# EasyEDA schematic SCH_N64-PSU_2023-12-16.json
TITLE: N64 DC Power Board; REV: 1.0; Date: 2023-05-23; Sheet: 1/1; Drawn By: jonn.blanchard; Company: RE:Enthused
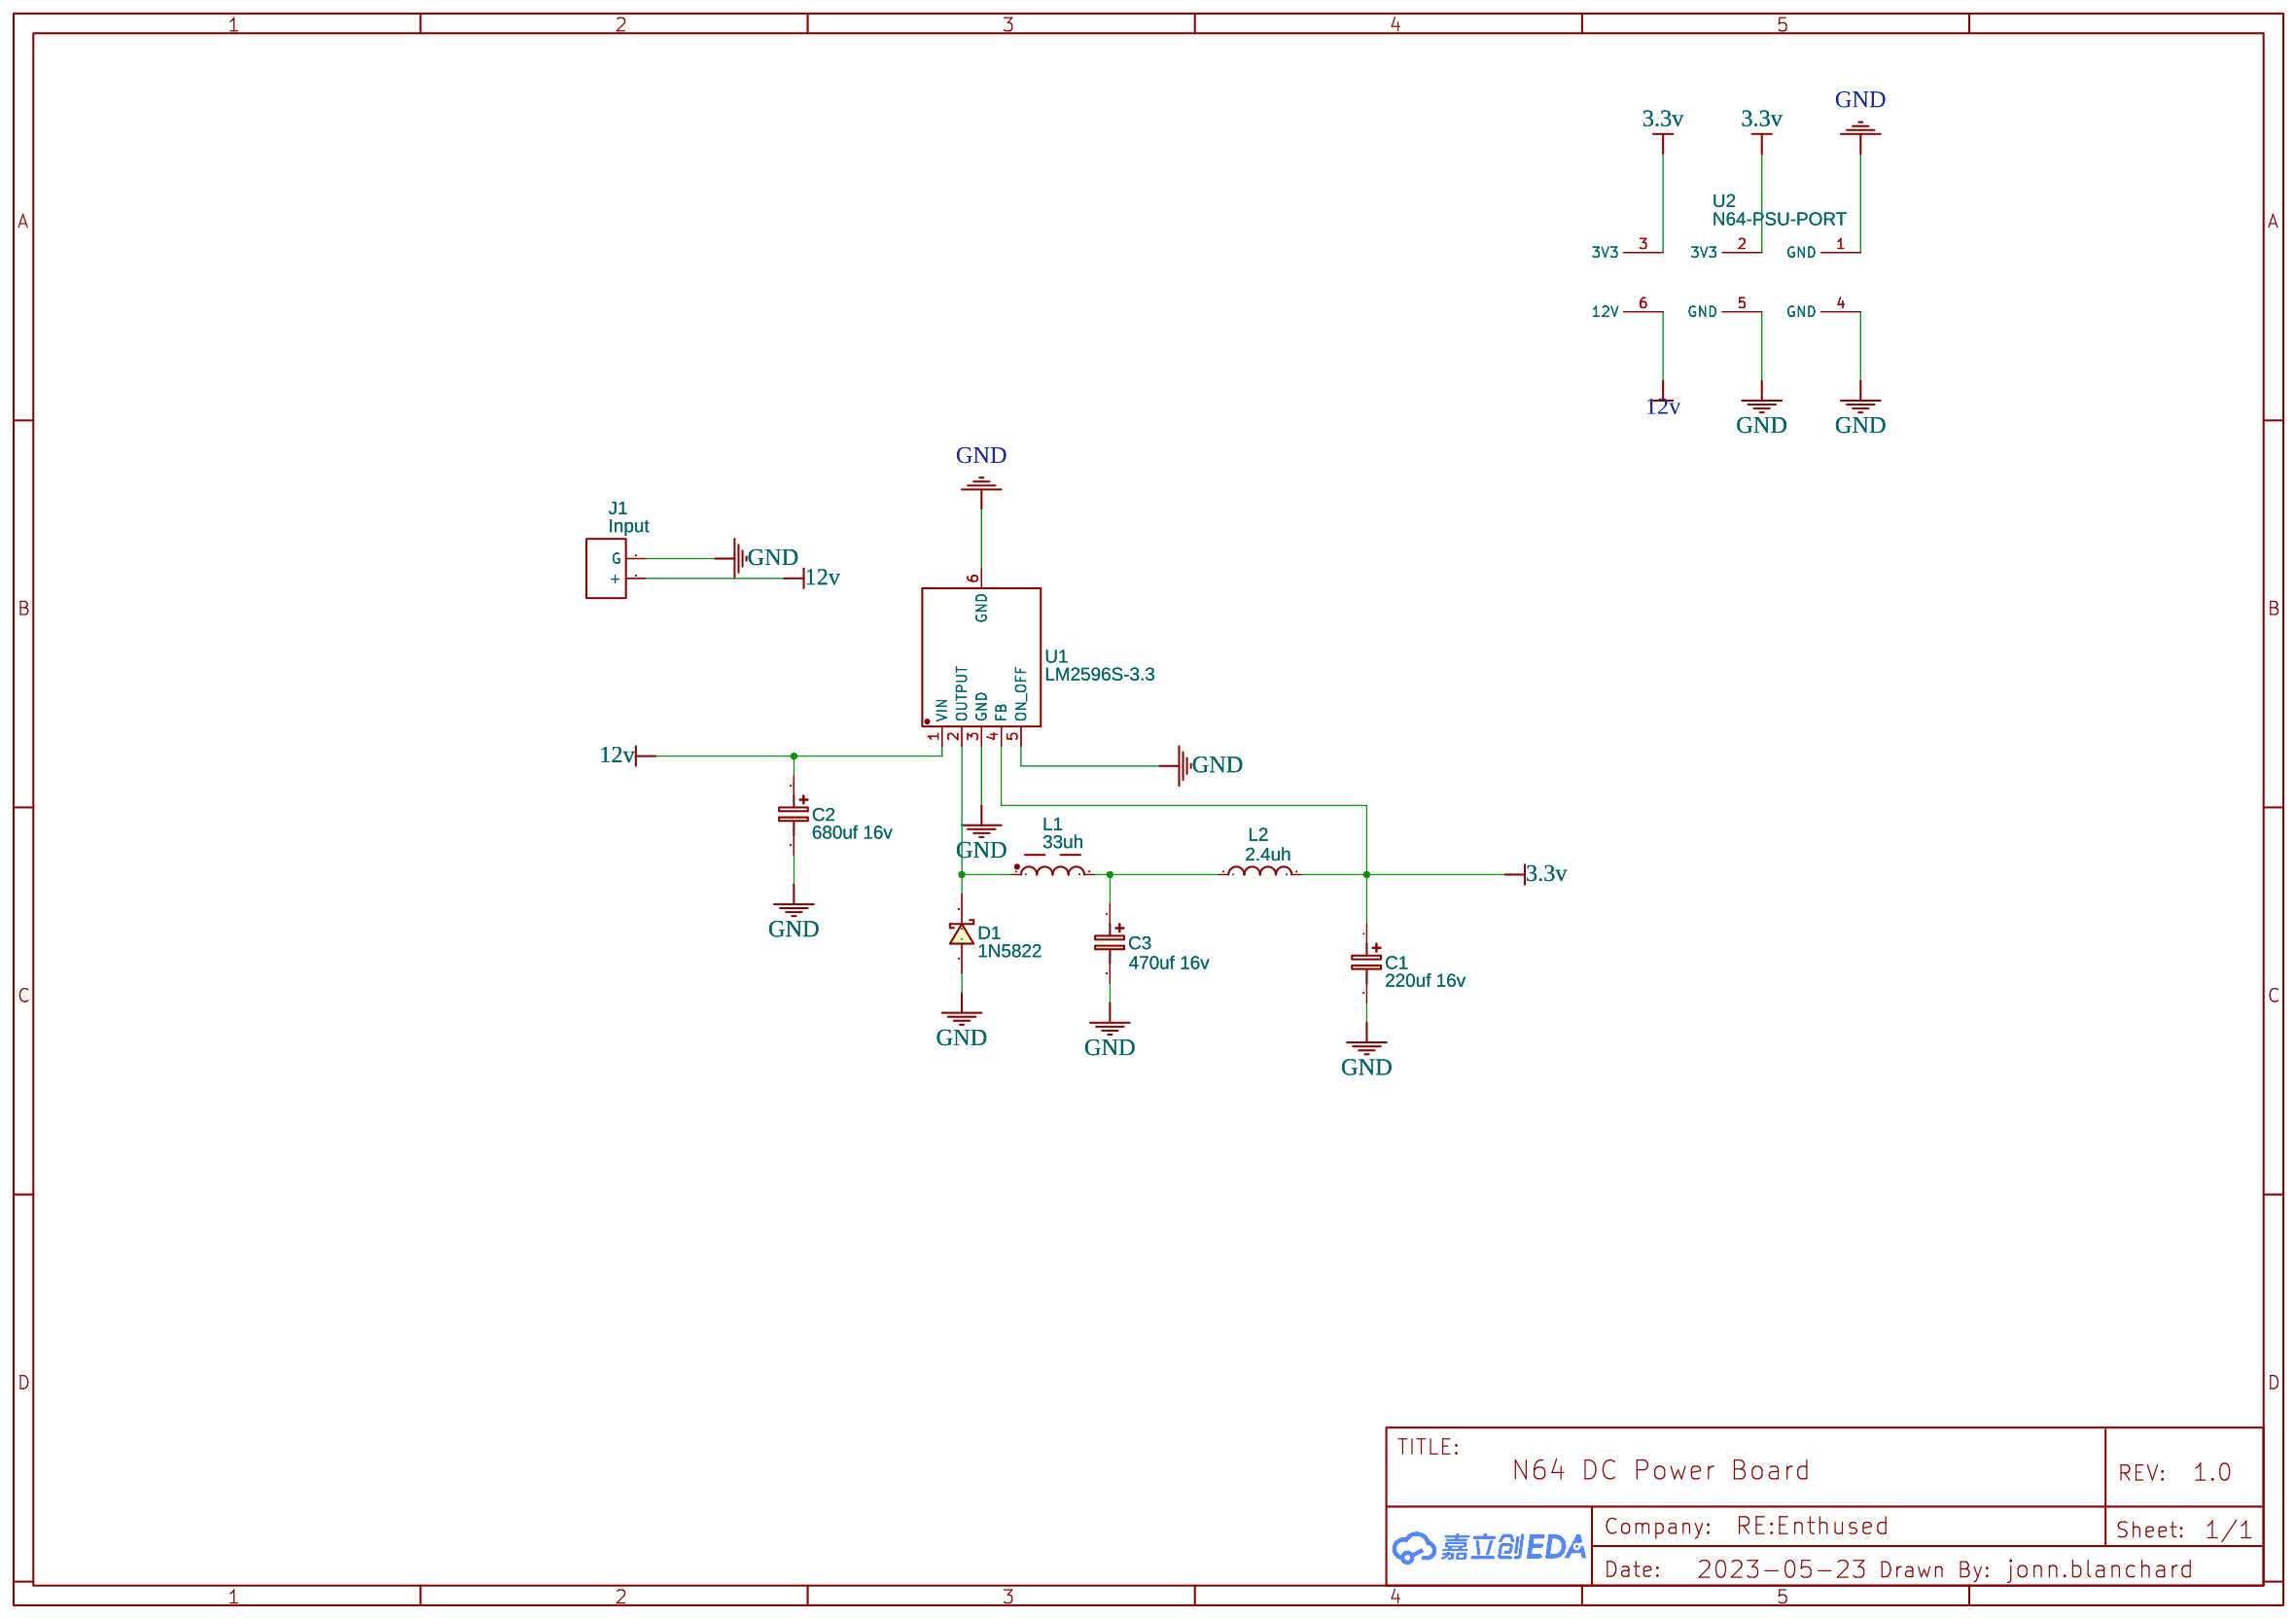
[diagram p0: schematic sheet]

## Parts
C1  220uf 16v  [CAP-D6.3×F2.5]
C2  680uf 16v  [CAP-D6.3×F2.5]
C3  470uf 16v  [CAP-D6.3×F2.5]
D1  1N5822  [1N5822]
J1  Input  [HDR-M-2.54_1X2]
L1  33uh  [FIXED IND 33UH 4.2A 45 MOHM - 1212]
L2  2.4uh  [WE-CHSA P PERFORMANCE SMT HIGH CURRENT INDUCTOR - 8090]
U1  LM2596S-3.3  [TO-263-5_L10.1-W8.7-P1.70-LS15.2-BR]
U2  N64-PSU-PORT  [N64-PSU-PORT]

## Library data of the parts
C1-C3 = CE_TH_D6.3×F2.5_EU: Contributor: LCEDA_Lib
D1 = 1N5822: Manufacturer Part: 1N5822-E3/73; Supplier: Digi-Key; Supplier Part: 1N5822-E3/73GITB-ND; link: https://www.digikey.fr/product-detail/fr/vishay-semiconductor-diodes-division/1N5822-E3-73/1N5822-E3-73GITB-ND/2139982; Contributor: rom1nux
J1 = HDR-M-2.54_1x2: Supplier Part: C124375; Supplier: LCSC; Contributor: LCEDA_Lib
L1 = FIXED IND 33UH 4.2A 45 MOHM - 1212: Manufacturer: Wurth Eletronik; Manufacturer Part: 7447709330; Supplier: Digi-Key; Supplier Part: 732-1244-1-ND; Contributor: jonn.blanchard
L2 = WE-CHSA P Performance SMT High Current Inductor - 8090: Manufacturer: Wurth Eletronik; Manufacturer Part: 78433490240; Supplier: Digi-Key; Supplier Part: 732-78433490240CT-ND; Contributor: jonn.blanchard
U1 = LM2596S-3.3RG_C5189649: Supplier: LCSC; Supplier Part: C5189649; Manufacturer: HGC(深圳汉芯); Manufacturer Part: LM2596S-3.3RG; link: https://atta.szlcsc.comnull; Contributor: lcsc
U2 = N64-PSU-PORT: Contributor: jonn.blanchard

## Nets
3.3v: C1.1 L2.2 U1.4(FB) U2.2(3V3) U2.3(3V3)
12v: C2.1 J1.1(+) U1.1(VIN) U2.6(12V)
GND: C1.2 C2.2 C3.2 D1.1(A) J1.2(G) U1.3(GND) U1.5(ON_OFF) U1.6(GND) U2.1(GND) U2.4(GND) U2.5(GND)
Net-(C3-1): C3.1 L1.2 L2.1
Net-(D1-2): D1.2(K) L1.1 U1.2(OUTPUT)
